# EAGLE design tempeh_Hat (EAGLE 9.4.2)
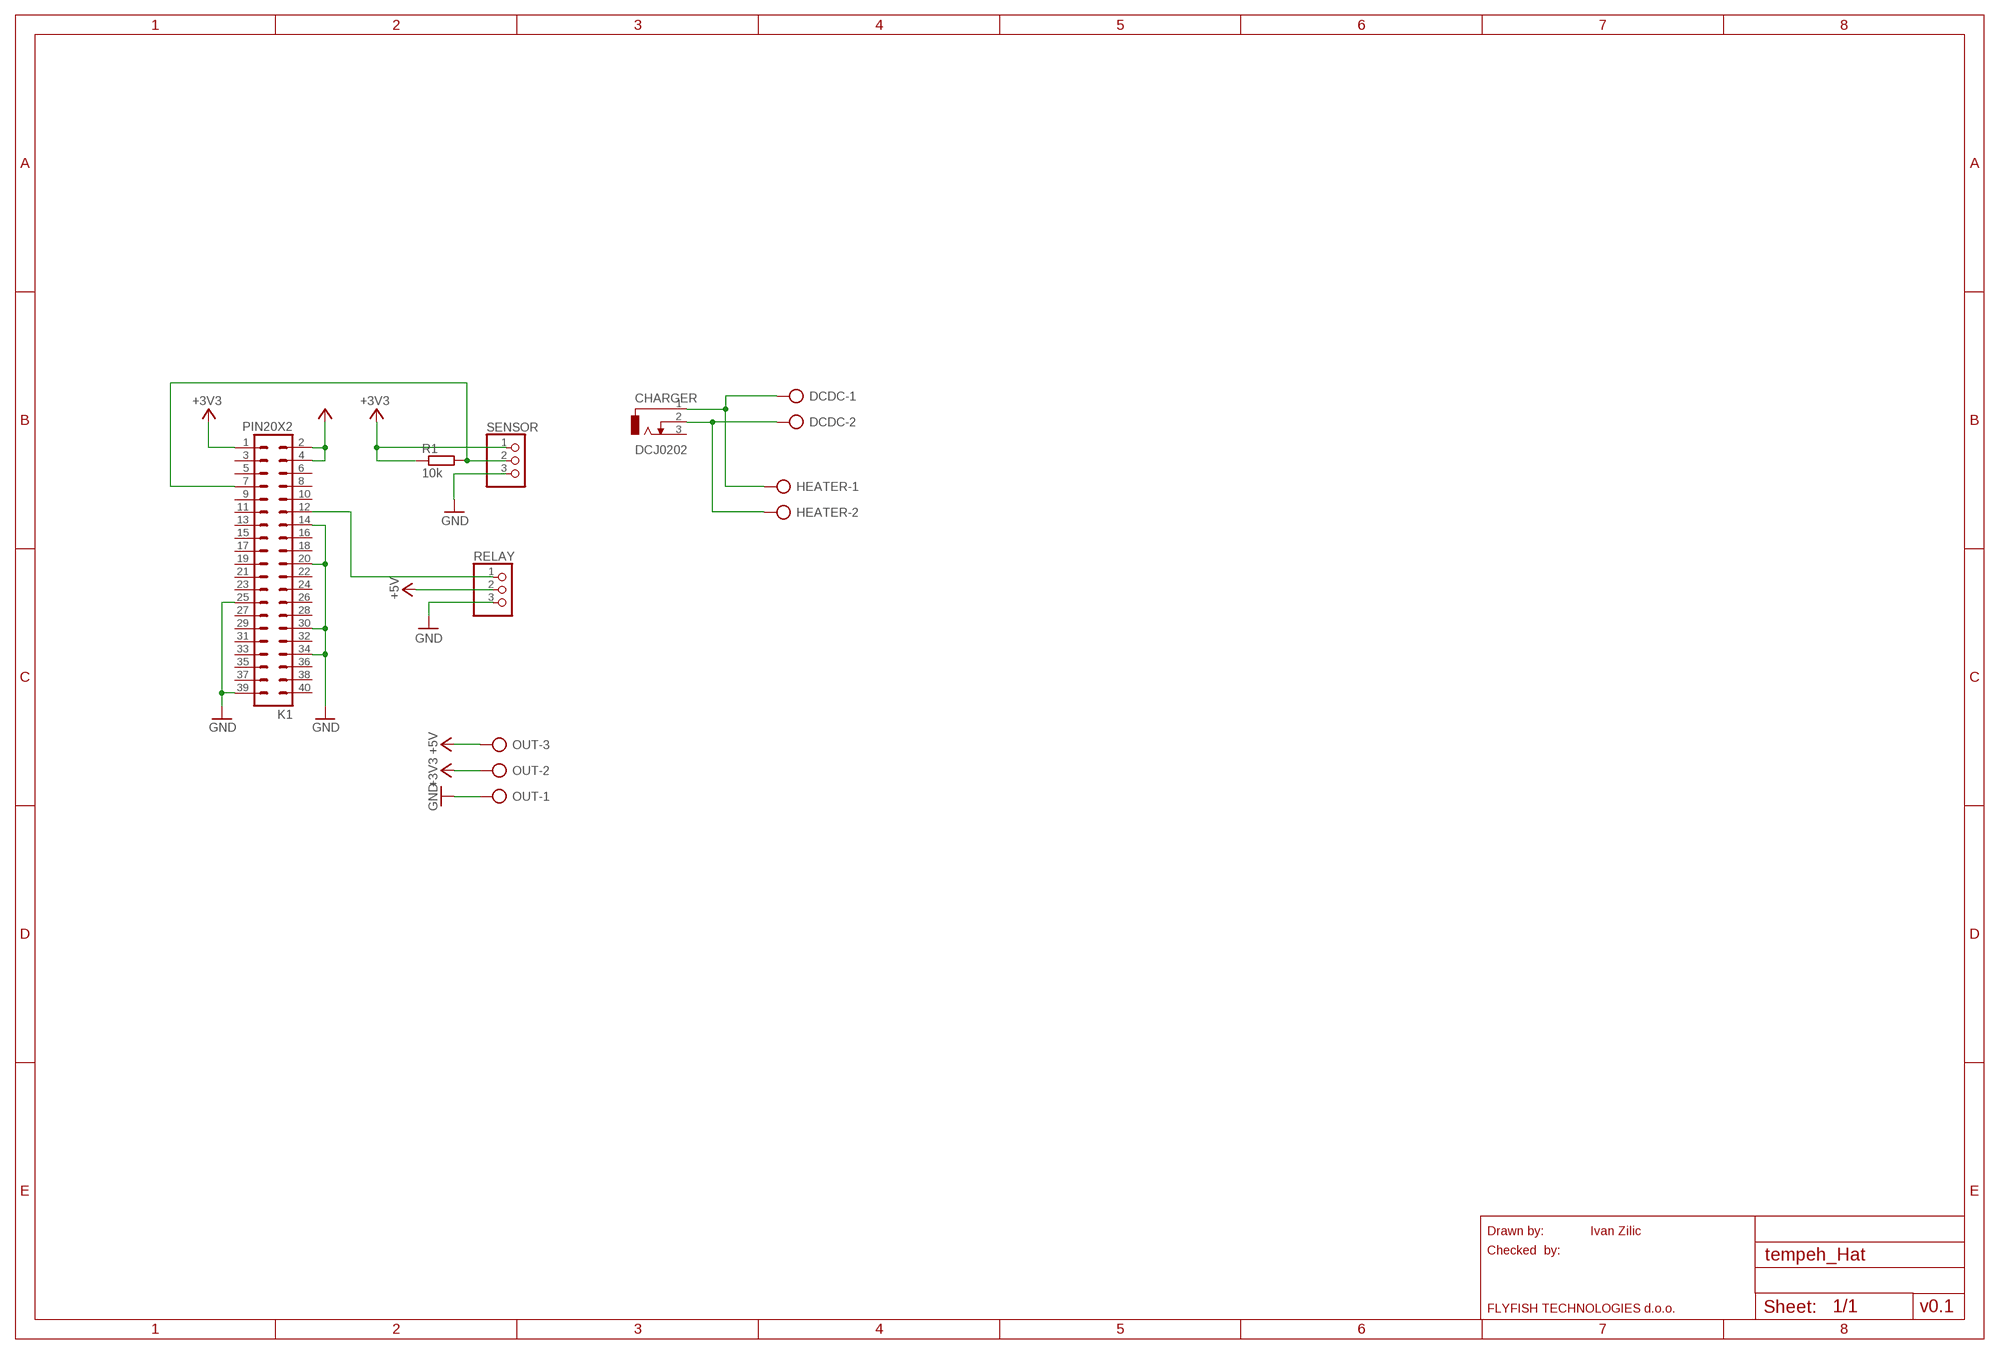
[diagram p0: schematic, sheet 1]

## Parts
CHARGER  DCJ0202  [DCJ0202]
DCDC  AK300/2  [AK300/2]
HEATER  AK300/2  [AK300/2]
K1  PIN20X2  [PIN_20X2]
OUT  AK300/3  [AK300/3]
R1  10k  R-EU_0204/7  [0204/7]
RELAY  PINHD-1X3  [1X03]
SENSOR  PINHD-1X3  [1X03]

## Nets
+3V3: K1.1 OUT.2 R1.1 SENSOR.1
+5V: K1.2 K1.4 OUT.3 RELAY.2
GND: K1.14 K1.20 K1.25 K1.30 K1.34 K1.39 OUT.1 RELAY.3 SENSOR.3
N$1: K1.7 R1.2 SENSOR.2
N$2: K1.12 RELAY.1
N$5: CHARGER.1 DCDC.1 HEATER.1
N$6: CHARGER.2 DCDC.2 HEATER.2
Unconnected: CHARGER.3 K1.3 K1.5 K1.6 K1.8 K1.9 K1.10 K1.11 K1.13 K1.15 K1.16 K1.17 K1.18 K1.19 K1.21 K1.22 K1.23 K1.24 K1.26 K1.27 K1.28 K1.29 K1.31 K1.32 K1.33 K1.35 K1.36 K1.37 K1.38 K1.40

## Notes on the sheet
- Drawn by: | Ivan Zilic
- Checked  by:
- FLYFISH TECHNOLOGIES d.o.o. | v0.1

## Library data of the parts
CHARGER = con-jack:DCJ0202: DC POWER JACK Source: DCJ0202.pdf; OC_FARNELL: unknown; OC_NEWARK: unknown
DCDC HEATER = con-ptr500:AK300/2: CONNECTOR; OC_FARNELL: unknown; OC_NEWARK: unknown
K1 = FLYFISH:PIN20X2
OUT = con-ptr500:AK300/3: CONNECTOR; OC_FARNELL: unknown; OC_NEWARK: unknown
R1 = rcl:R-EU_: RESISTOR, European symbol; SPICEPREFIX: R
RELAY SENSOR = pinhead:PINHD-1X3: PIN HEADER

## Net classes
0 default: width 0.305 mm, drill 0.508 mm, clearance 0.254 mm

## Board
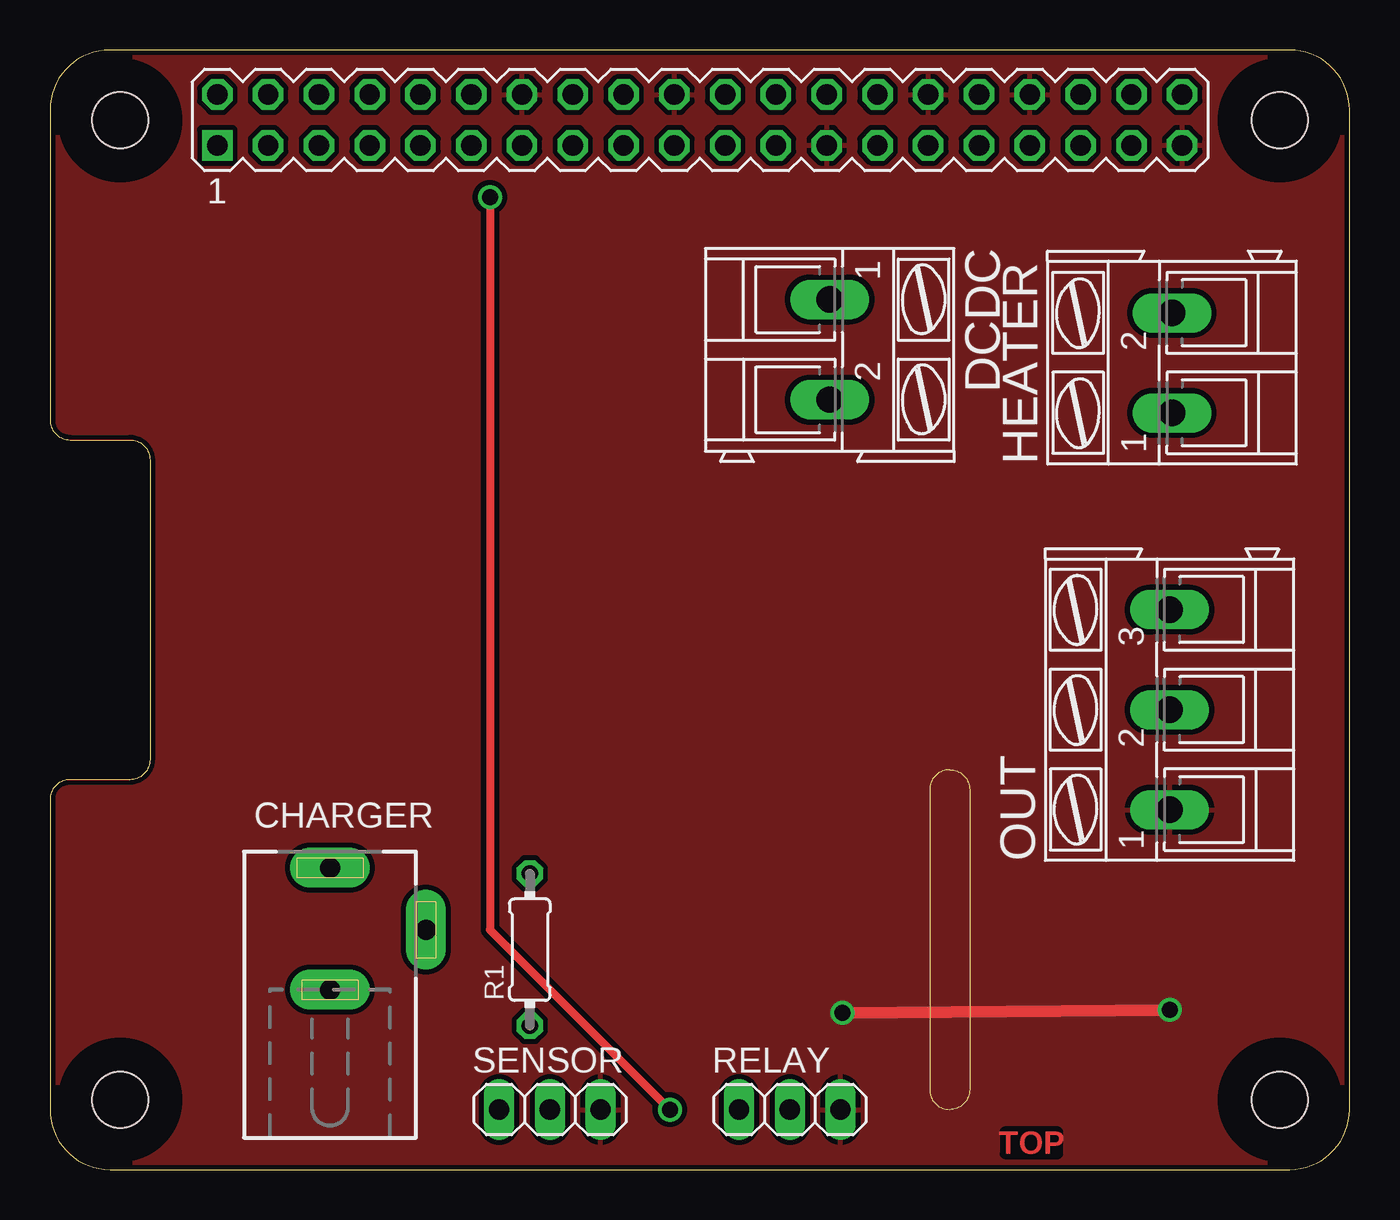
[diagram p1: board, top side]
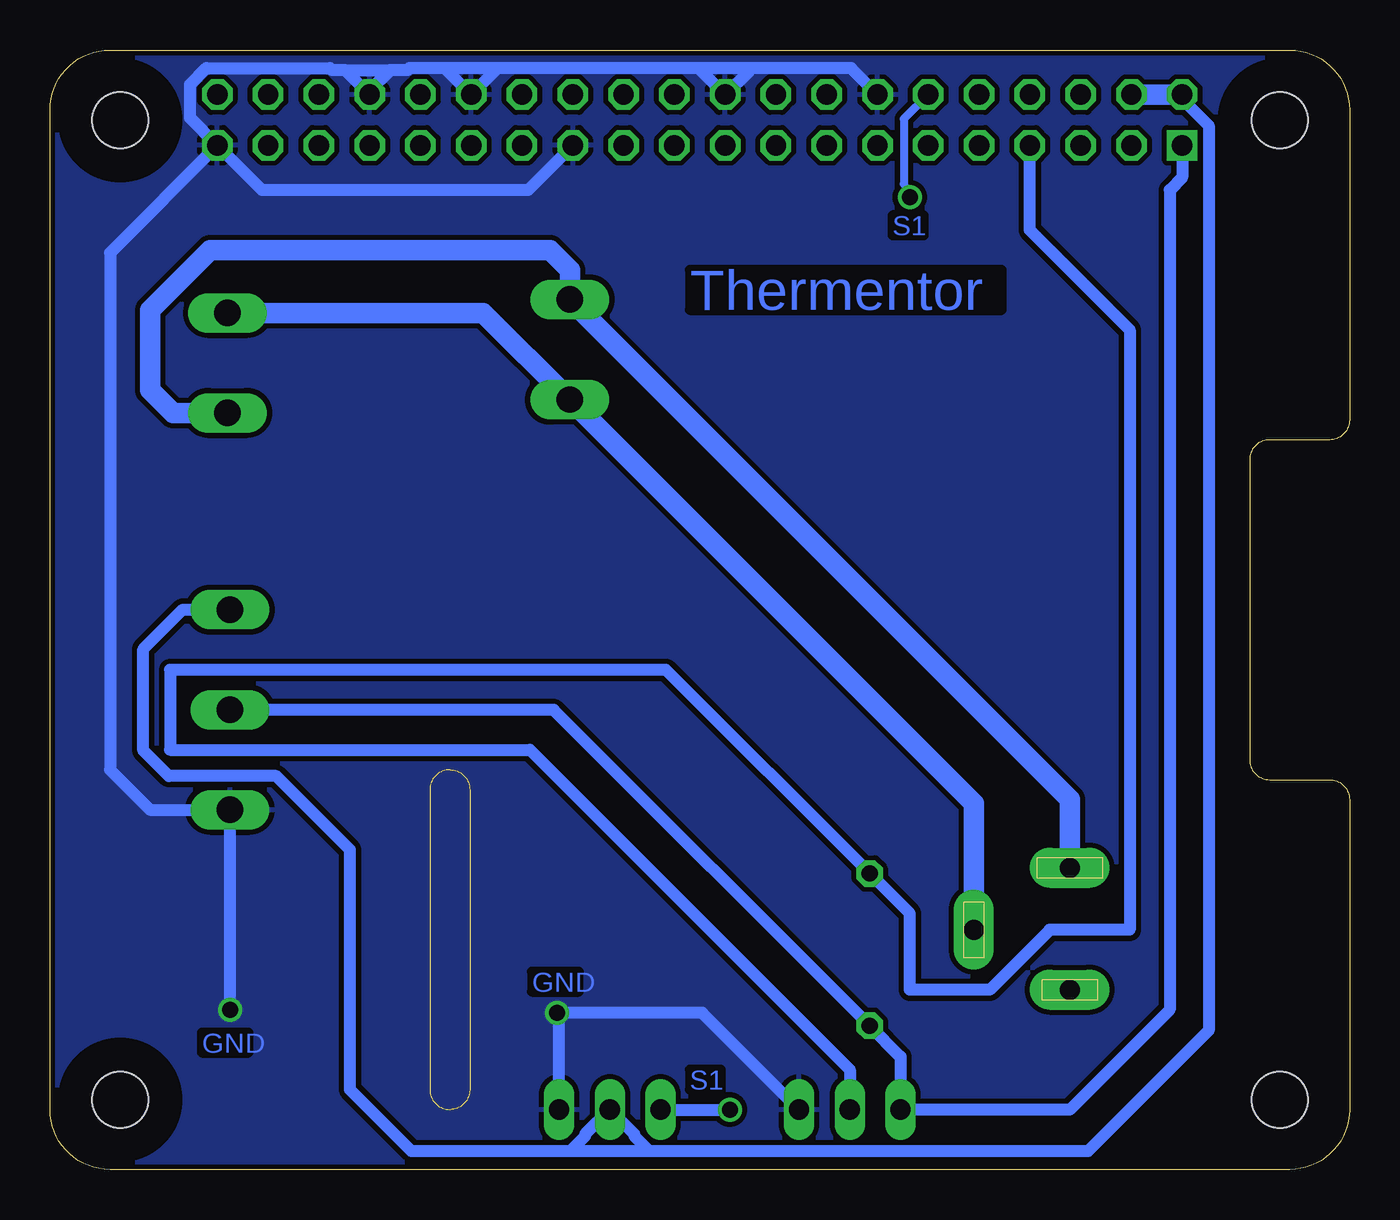
[diagram p2: board, bottom side, seen from below]

Size 65 x 56 mm. Coordinates in mm from the lower left corner, seen from the top.
Outline: 0,3 arc90 3,0 62,0 arc90 65,3 65,53 arc90 62,56 3,56 arc90 0,53 0,37.5 arc90 1,36.5 4,36.5 arc-90 5,35.5 5,20.5 arc-90 4,19.5 1,19.5 arc90 0,18.5 0,3
Copper layers (1*16): Top 0.035mm / dielectric 1.5mm / Bottom 0.035mm
Design rules "ITEADstudio_DRC": minimum track width 6mil, minimum drill 12mil, track to track 6mil, track to pad 6mil, pad to pad 6mil, via to via 6mil, smd to smd 0mil, copper to edge 10mil, drill to drill 10mil, minimum pad ring 10mil, minimum via ring 6mil, stop-mask expansion 2mil, vias tented up to drill 100mil, thermal gap 10mil
Holes 2.8 mm at 3.5,3.5 3.5,52.5 61.5,52.5 61.5,3.5
tRestrict: area 1.9,51 to 5,54; area 60,51 to 63,54; area 60,1.9 to 63,5; area 1.9,1.9 to 5,5
bRestrict: area 1.9,1.9 to 5,5; area 1.9,51 to 5,54; area 60,1.9 to 63,5; area 60,51 to 63,54
Milling: 6 lines

### Footprints (pad centres in the part's own frame; a part is rotated, then mirrored left to right if it is on the bottom)
DCJ0202 = drill 1 pad 2 long: 1 0,3.1; 2 4.8,0; 3 0,-3
AK300/2 = drill 1.321 long: 1 -2.515,0; 2 2.489,0
PIN_20X2 = drill 1.016 square: 1 -24.13,-1.27 | drill 1.016 octagon: 2 -24.13,1.27; 3 -21.59,-1.27; 4 -21.59,1.27; 5 -19.05,-1.27; 6 -19.05,1.27; 7 -16.51,-1.27; 8 -16.51,1.27; 9 -13.97,-1.27; 10 -13.97,1.27; 11 -11.43,-1.27; 12 -11.43,1.27; 13 -8.89,-1.27; 14 -8.89,1.27; 15 -6.35,-1.27; 16 -6.35,1.27; 17 -3.81,-1.27; 18 -3.81,1.27; 19 -1.27,-1.27; 20 -1.27,1.27; 21 1.27,-1.27; 22 1.27,1.27; 23 3.81,-1.27; 24 3.81,1.27; 25 6.35,-1.27; 26 6.35,1.27; 27 8.89,-1.27; 28 8.89,1.27; 29 11.43,-1.27; 30 11.43,1.27; 31 13.97,-1.27; 32 13.97,1.27; 33 16.51,-1.27; 34 16.51,1.27; 35 19.05,-1.27; 36 19.05,1.27; 37 21.59,-1.27; 38 21.59,1.27; 39 24.13,-1.27; 40 24.13,1.27
AK300/3 = drill 1.321 long: 1 -5.004,0; 2 0,0; 3 5.004,0
0204/7 = drill 0.813 octagon: 1 -3.81,0; 2 3.81,0
1X03 = drill 1.016 long: 1 -2.54,0; 2 0,0; 3 2.54,0

### Placement (x,y rotation side)
CHARGER  14,12 0 top
DCDC  39,41 270 top
HEATER  56.12,40.36 90 top
K1  32.5,52.5 0 top
OUT  56,23 90 top
R1  24,11 90 top
RELAY  37,3 0 top
SENSOR  25,3 0 top

### Tracks (layer width: path | path; a pad name or v marks a point on that pad's centre or on a via)
+3V3
  Bottom 0.61: OUT.2 39.81,23 R1.1 22.46,5.65 SENSOR.1 14,3 9,8 9,49 8.37,49.63 K1.1
+5V
  Bottom 0.61: K1.2 8.37,53.54 7.05,52.22 7.05,6.95 13.08,0.92 35.01,0.92 | 35.01,0.92 35.78,1.69 35.78,1.78 RELAY.2 38.22,1.78 38.22,1.69 38.99,0.92 | 35.01,0.92 38.99,0.92 | OUT.3 58.36,28 60.33,26.04 60.33,20.95 59.05,19.68 53.69,19.68 50,16 50,4 46.92,0.92 39,0.92 38.99,0.92
  Bottom 1.016: K1.2 K1.4
GND  (via drill 0.8)
  Top 0.61: v39.63,7.84 v56,8
  Bottom 0.61: K1.39 62,45.86 62,20 60,18 OUT.1 v56,8 | K1.25 41.08,49 54.4,49 K1.39 | 48,55 47.11,55 47.02,55.09 45.25,55.09 | 32.55,55.09 42.61,55.09 | 42.61,55.09 45.25,55.09 | 32.55,55.09 K1.20 30,55 30,55.09 | 48,55 49.01,53.99 K1.34 50.24,55 | 42.61,55.09 K1.30 45.25,55.09 | K1.14 24.93,55.09 30,55.09 | 30,55.09 32.55,55.09 | K1.39 58,52.6 58,54.27 57.18,55.09 51,55.09 50.91,55 50.24,55 | 50.24,55 48,55 | SENSOR.3 32.38,7.84 v39.63,7.84 39.54,7.75 RELAY.3
  pour Bottom: 0,3 arc90 3,0 62,0 arc90 65,3 65,53 arc90 62,56 3,56 arc90 0,53 0,37.5 arc90 1,36.5 4,36.5 arc-90 5,35.5 5,20.5 arc-90 4,19.5 1,19.5 arc90 0,18.5
  pour Top: 0,3 arc90 3,0 62,0 arc90 65,3 65,53 arc90 62,56 3,56 arc90 0,53 0,37.5 arc90 1,36.5 4,36.5 arc-90 5,35.5 5,20.5 arc-90 4,19.5 1,19.5 arc90 0,18.5
N$1
  Bottom 0.61: SENSOR.2 25,5 41,21 59,21 59,25 34.19,25 R1.2 22,12.81 22,9 18,9 15,12 11,12 11,42 16,47 K1.7
N$2  (via drill 0.51, 0.8)
  Top 0.406: v22,48.63 22,12 v31,3
  Bottom 0.406: K1.12 22.29,52.55 22.29,49.29 v22,48.63
  Bottom 0.61: RELAY.1 v31,3
  other vias: 34.46,3
N$5
  Bottom 1.016: HEATER.1 58.84,37.84 60,39 60,43 57,46 40,46 39,45 DCDC.1 14,18.52 CHARGER.1
N$6
  Bottom 1.016: HEATER.2 43.34,42.85 DCDC.2 18.8,18.31 CHARGER.2

### Text on the board
Top: TOP
Bottom: S1 | Thermentor | GND | GND | S1